# EAGLE schematic proto4-1pp (EAGLE 6.6.0), part 1 of 3
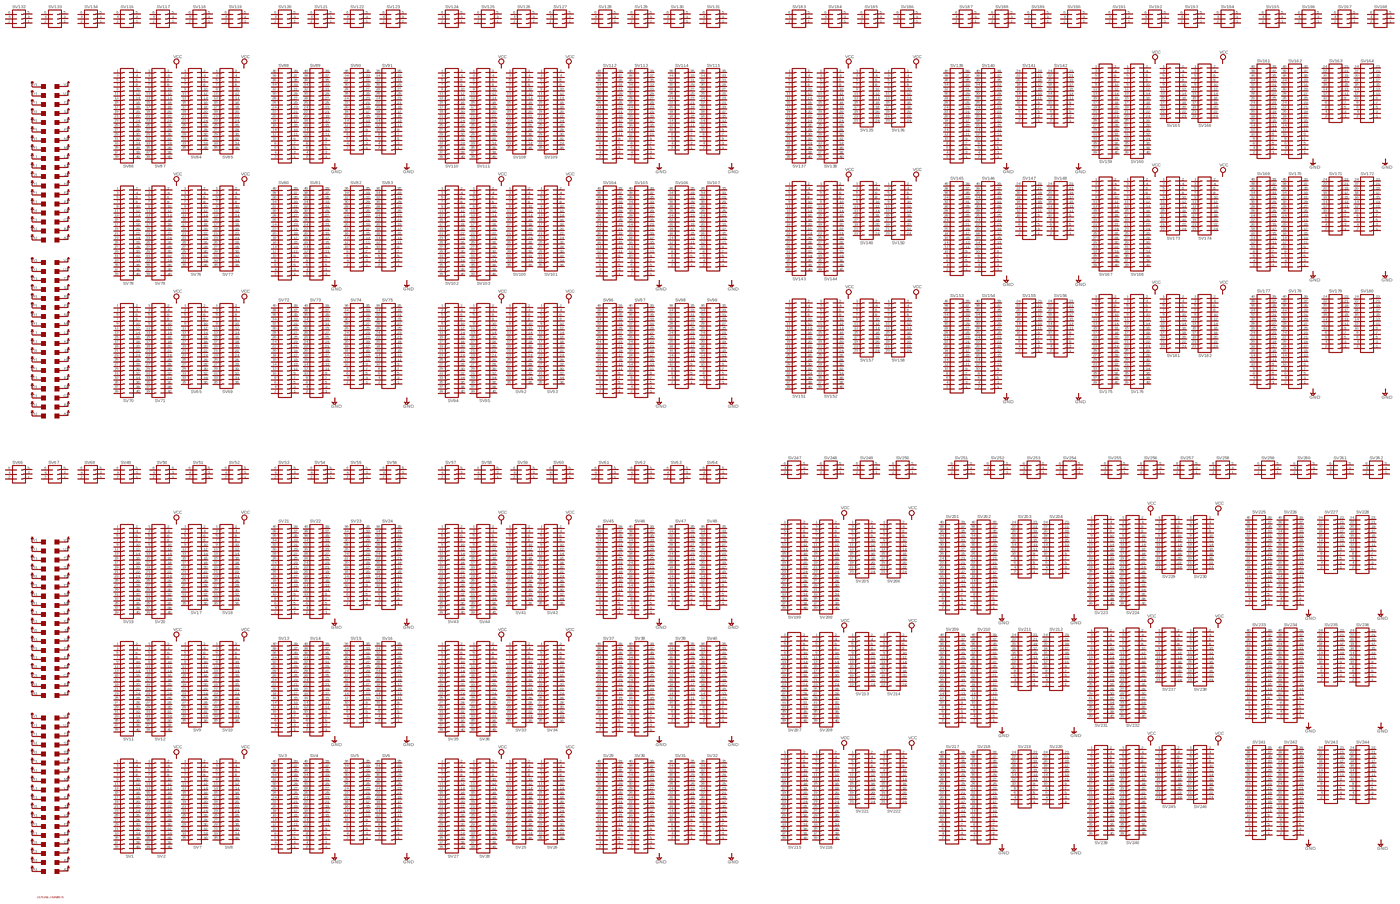
[diagram p0: schematic, sheet 1, overview]
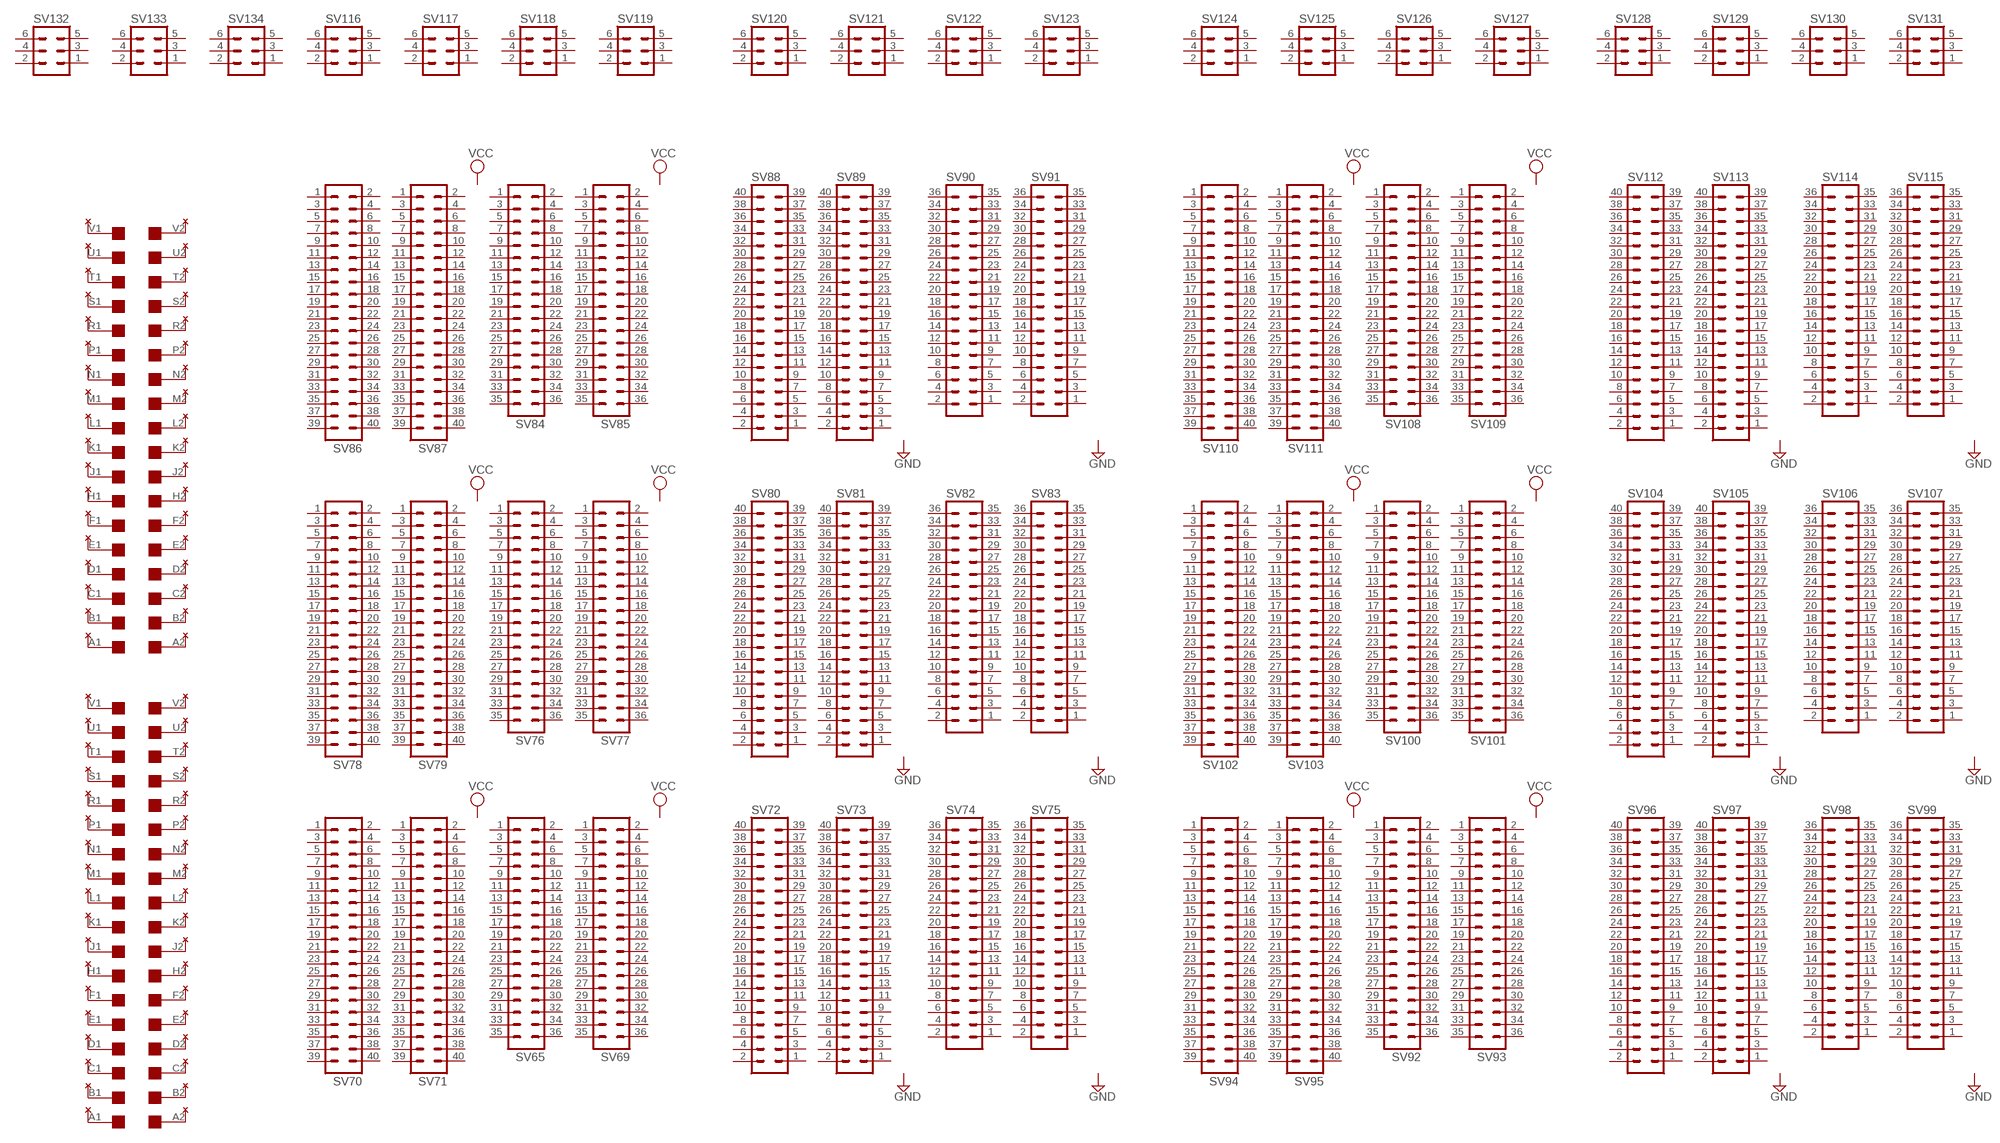
[diagram p1: schematic, sheet 1, part 1 of 4]
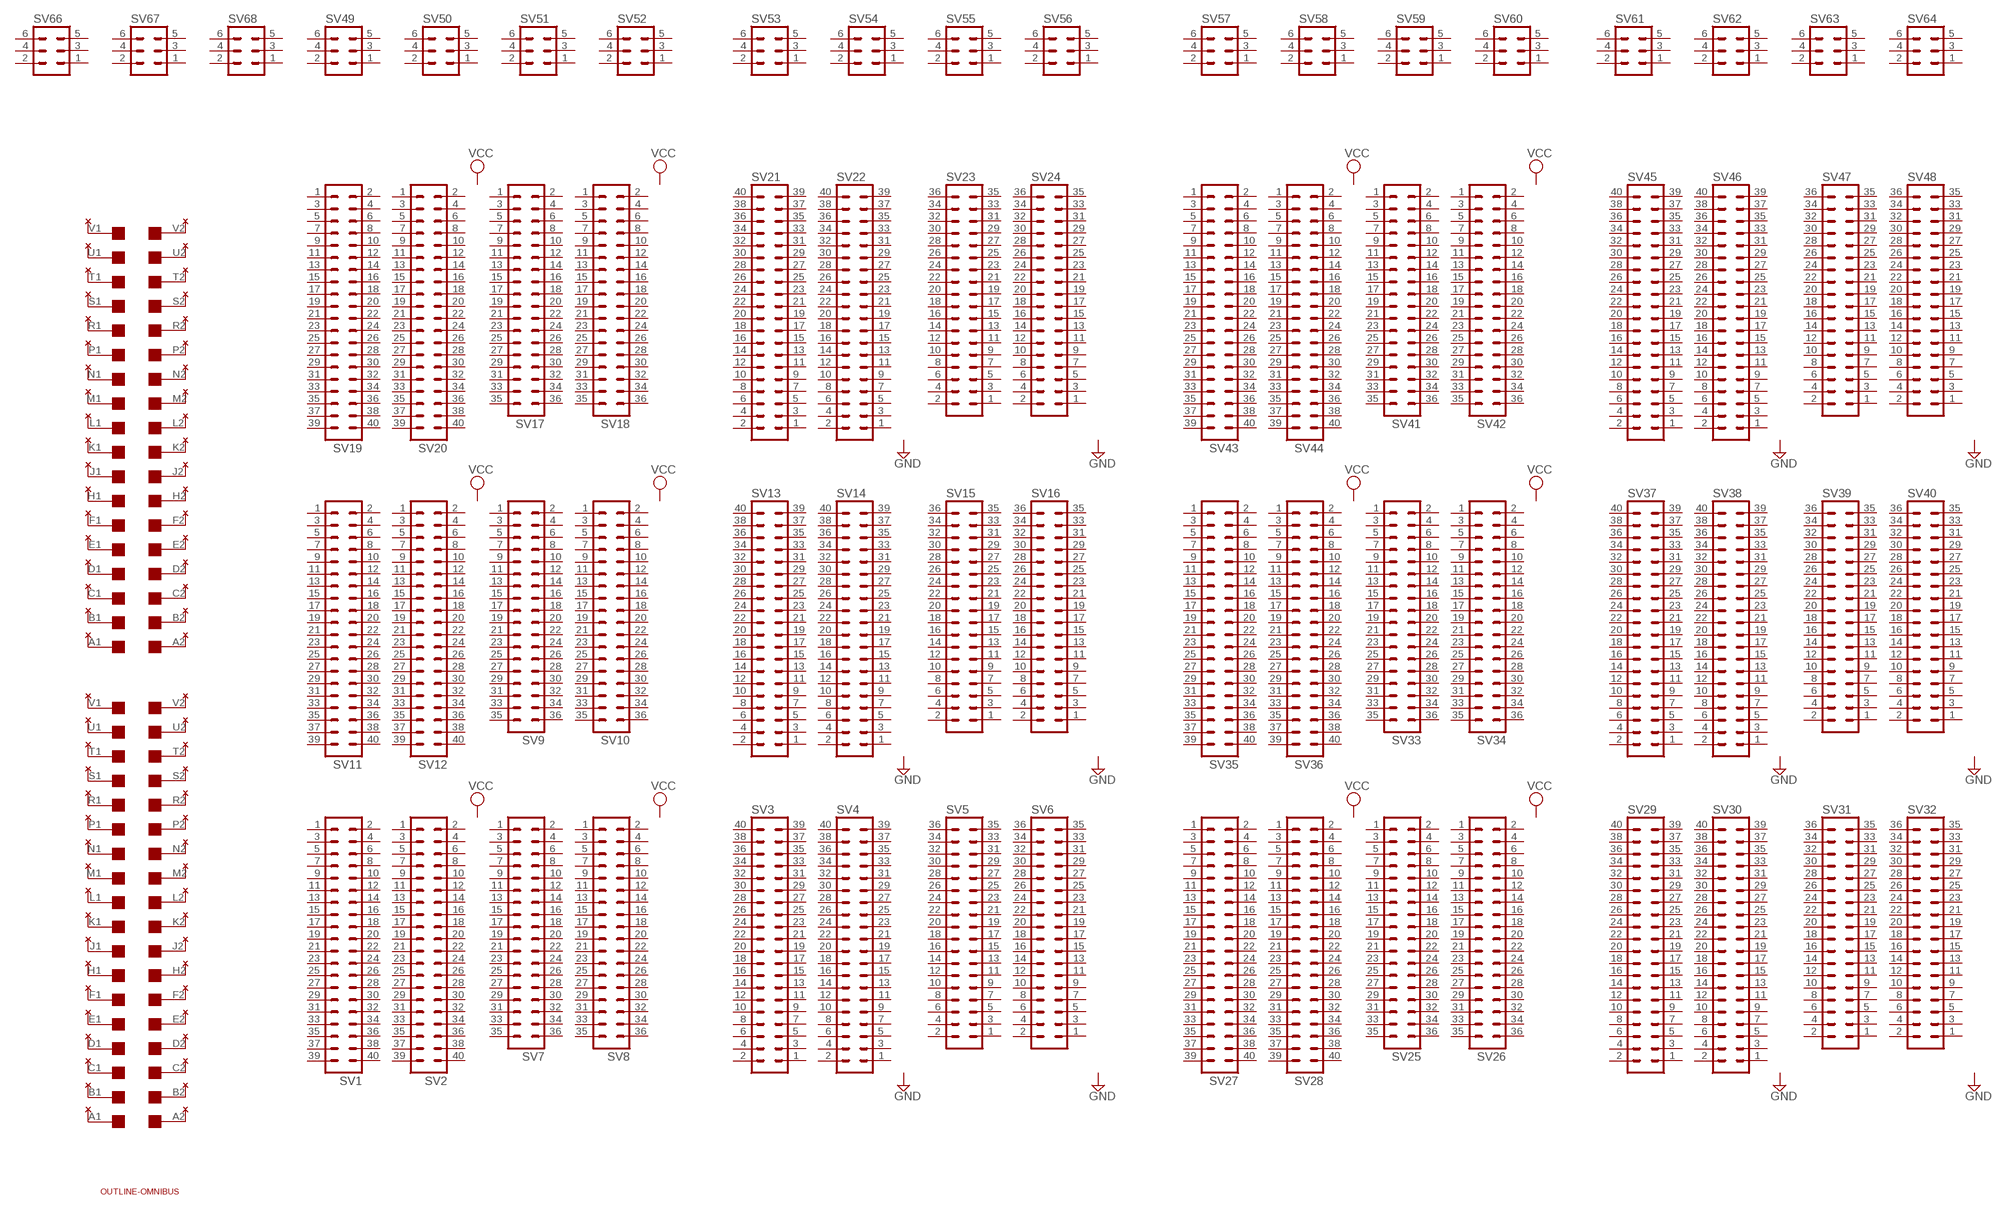
[diagram p2: schematic, sheet 1, part 2 of 4]
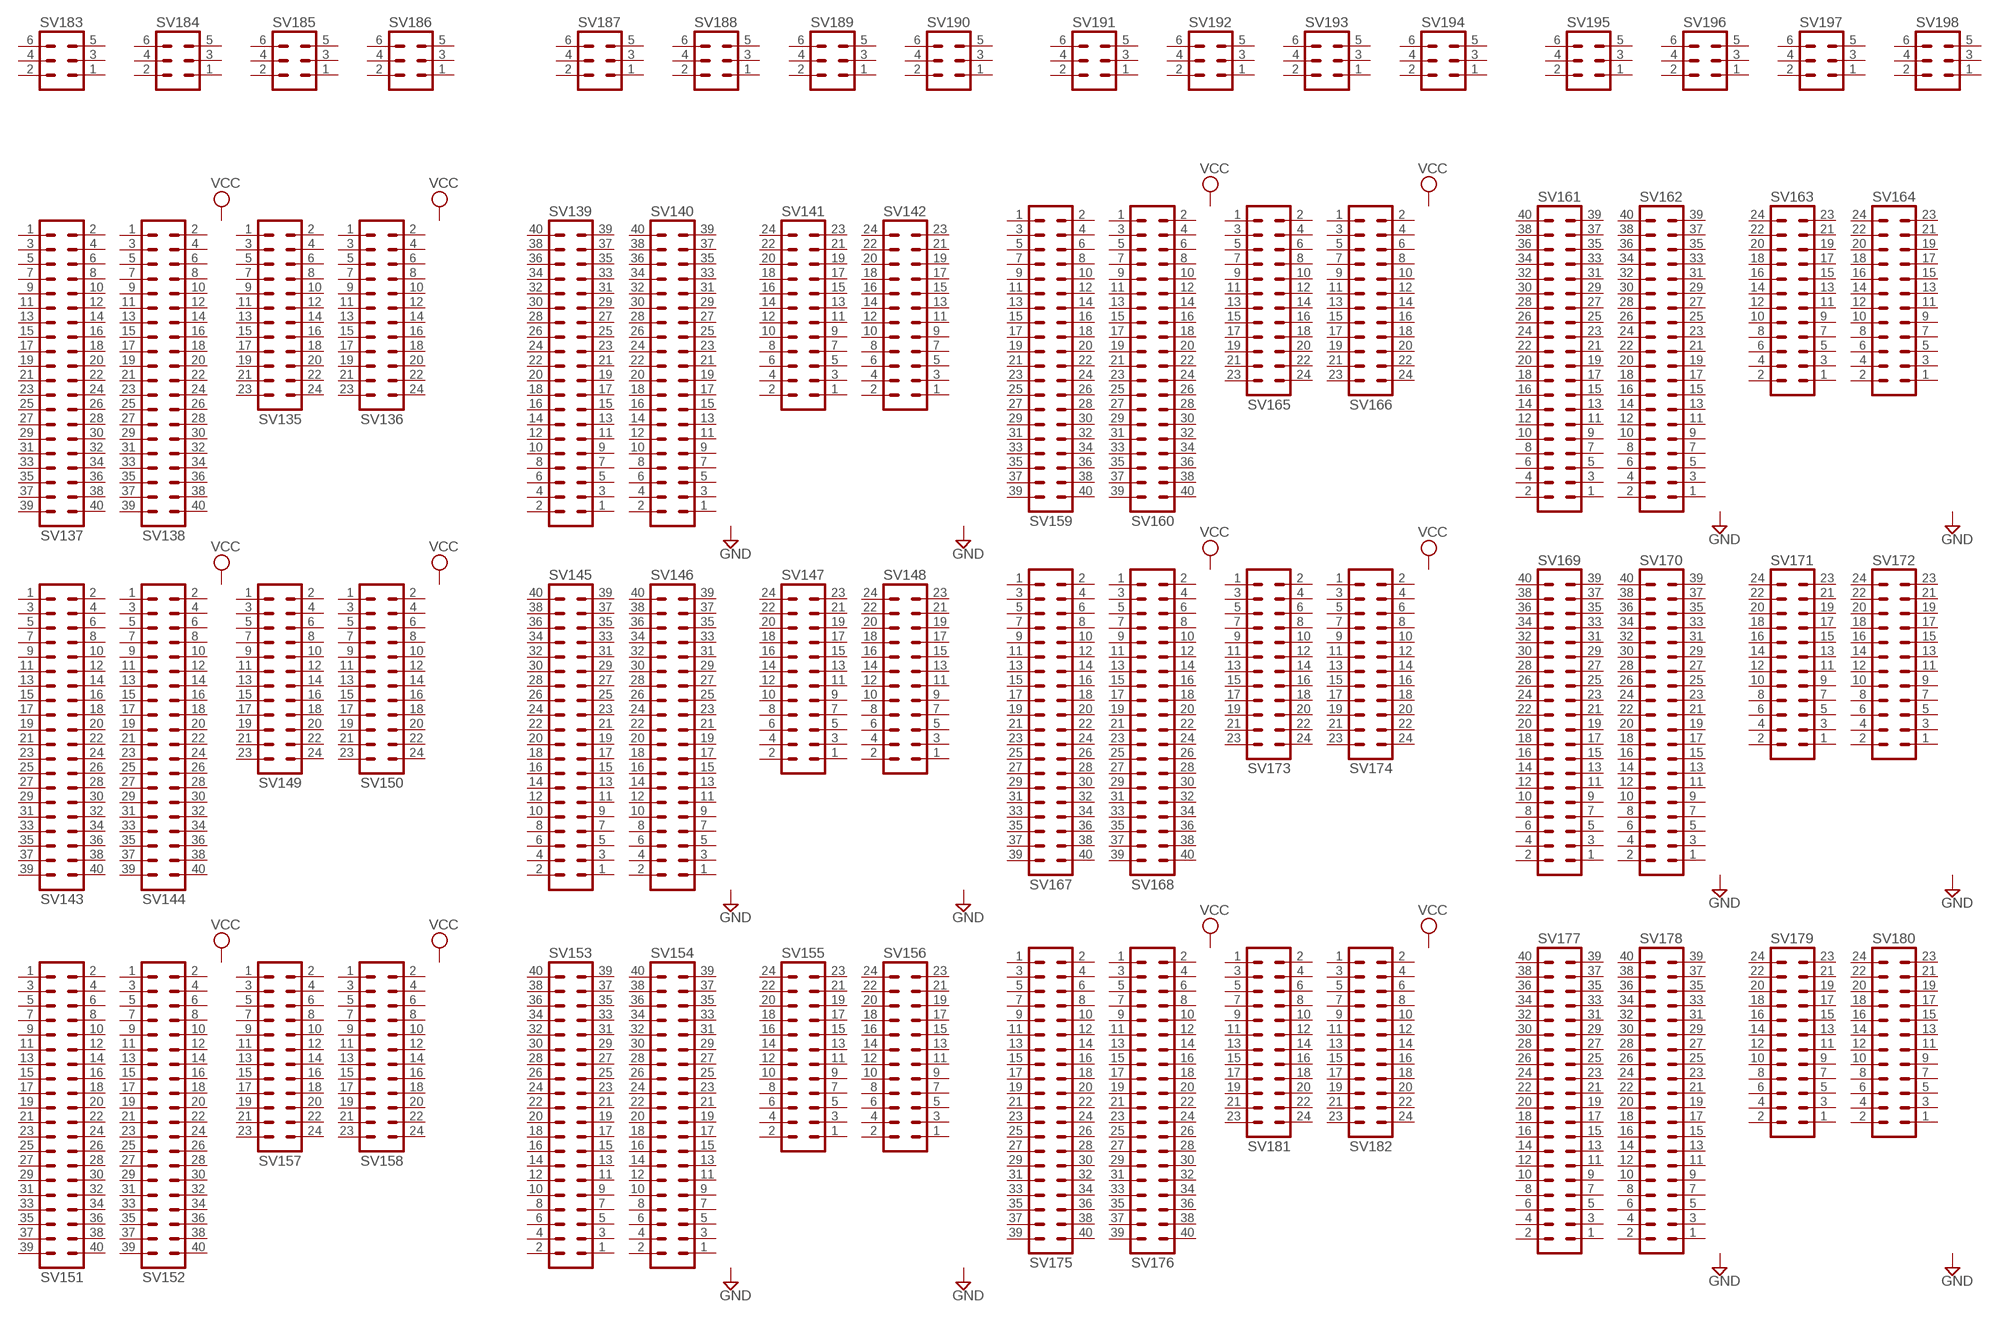
[diagram p3: schematic, sheet 1, part 3 of 4]
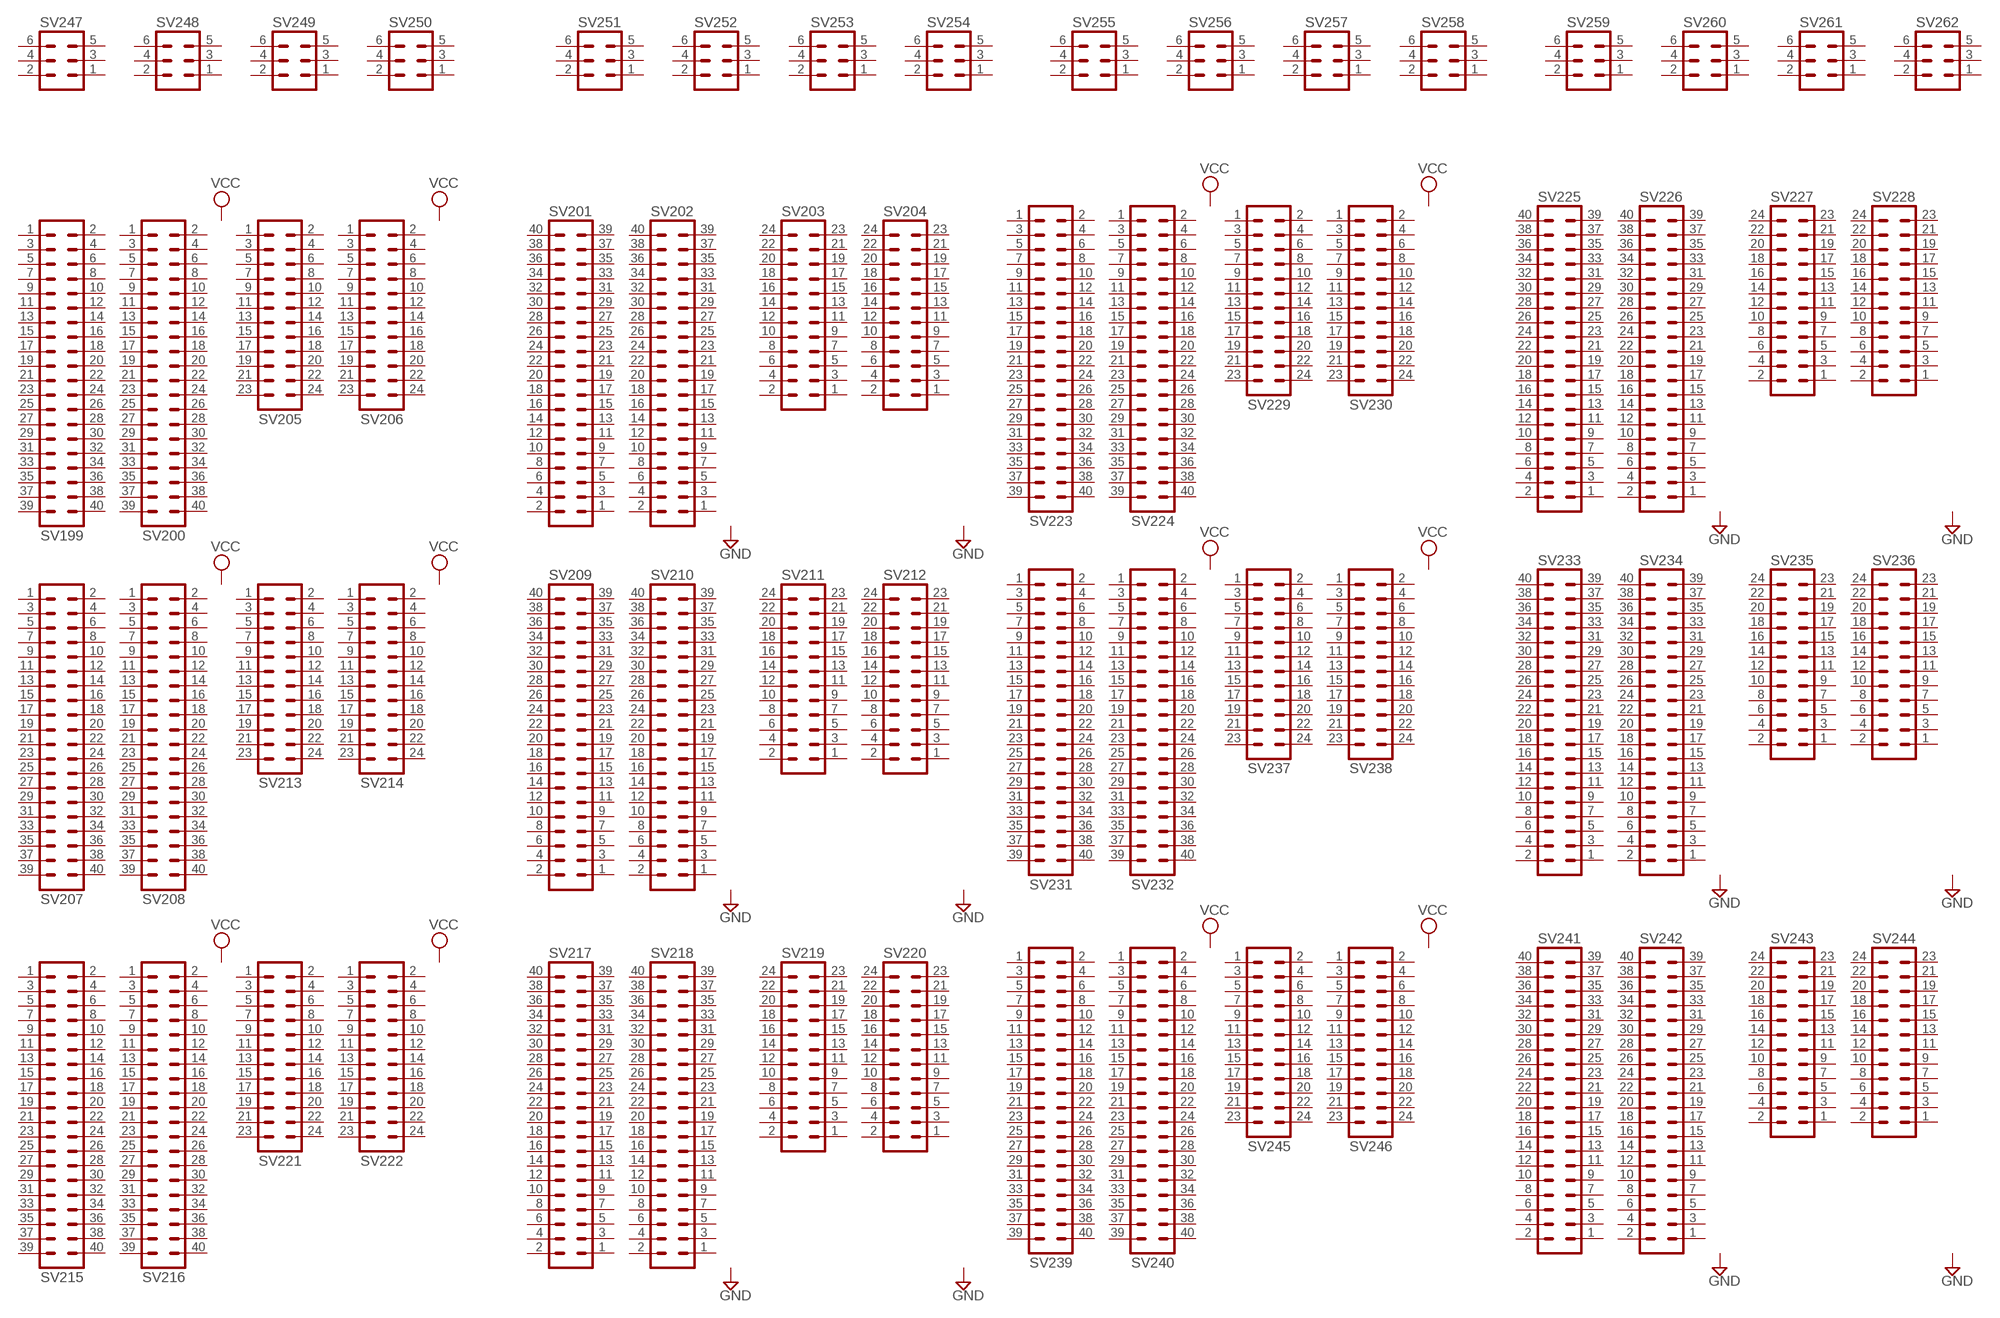
[diagram p4: schematic, sheet 1, part 4 of 4]

## Parts
A  EDGE-2CONNECTOR  [EDGE-CON2]
A1  EDGE-2CONNECTOR  [EDGE-CON2]
B  EDGE-2CONNECTOR  [EDGE-CON2]
B1  EDGE-2CONNECTOR  [EDGE-CON2]
SV1  MA20-2  [MA20-2]
SV2  MA20-2  [MA20-2]
SV3  MA20-2  [MA20-2]
SV4  MA20-2  [MA20-2]
SV5  MA18-2  [MA18-2]
SV6  MA18-2  [MA18-2]
SV7  MA18-2  [MA18-2]
SV8  MA18-2  [MA18-2]
SV9  MA18-2  [MA18-2]
SV10  MA18-2  [MA18-2]
SV11  MA20-2  [MA20-2]
SV12  MA20-2  [MA20-2]
SV13  MA20-2  [MA20-2]
SV14  MA20-2  [MA20-2]
SV15  MA18-2  [MA18-2]
SV16  MA18-2  [MA18-2]
SV17  MA18-2  [MA18-2]
SV18  MA18-2  [MA18-2]
SV19  MA20-2  [MA20-2]
SV20  MA20-2  [MA20-2]
SV21  MA20-2  [MA20-2]
SV22  MA20-2  [MA20-2]
SV23  MA18-2  [MA18-2]
SV24  MA18-2  [MA18-2]
SV25  MA18-2  [MA18-2]
SV26  MA18-2  [MA18-2]
SV27  MA20-2  [MA20-2]
SV28  MA20-2  [MA20-2]
SV29  MA20-2  [MA20-2]
SV30  MA20-2  [MA20-2]
SV31  MA18-2  [MA18-2]
SV32  MA18-2  [MA18-2]
SV33  MA18-2  [MA18-2]
SV34  MA18-2  [MA18-2]
SV35  MA20-2  [MA20-2]
SV36  MA20-2  [MA20-2]
SV37  MA20-2  [MA20-2]
SV38  MA20-2  [MA20-2]
SV39  MA18-2  [MA18-2]
SV40  MA18-2  [MA18-2]
SV41  MA18-2  [MA18-2]
SV42  MA18-2  [MA18-2]
SV43  MA20-2  [MA20-2]
SV44  MA20-2  [MA20-2]
SV45  MA20-2  [MA20-2]
SV46  MA20-2  [MA20-2]
SV47  MA18-2  [MA18-2]
SV48  MA18-2  [MA18-2]
SV49  MA03-2  [MA03-2]
SV50  MA03-2  [MA03-2]
SV51  MA03-2  [MA03-2]
SV52  MA03-2  [MA03-2]
SV53  MA03-2  [MA03-2]
SV54  MA03-2  [MA03-2]
SV55  MA03-2  [MA03-2]
SV56  MA03-2  [MA03-2]
SV57  MA03-2  [MA03-2]
SV58  MA03-2  [MA03-2]
SV59  MA03-2  [MA03-2]
SV60  MA03-2  [MA03-2]
SV61  MA03-2  [MA03-2]
SV62  MA03-2  [MA03-2]
SV63  MA03-2  [MA03-2]
SV64  MA03-2  [MA03-2]
SV65  MA18-2  [MA18-2]
SV66  MA03-2  [MA03-2]
SV67  MA03-2  [MA03-2]
SV68  MA03-2  [MA03-2]
SV69  MA18-2  [MA18-2]
SV70  MA20-2  [MA20-2]
SV71  MA20-2  [MA20-2]
SV72  MA20-2  [MA20-2]
SV73  MA20-2  [MA20-2]
SV74  MA18-2  [MA18-2]
SV75  MA18-2  [MA18-2]
SV76  MA18-2  [MA18-2]
SV77  MA18-2  [MA18-2]
SV78  MA20-2  [MA20-2]
SV79  MA20-2  [MA20-2]
SV80  MA20-2  [MA20-2]
SV81  MA20-2  [MA20-2]
SV82  MA18-2  [MA18-2]
SV83  MA18-2  [MA18-2]
SV84  MA18-2  [MA18-2]
SV85  MA18-2  [MA18-2]
SV86  MA20-2  [MA20-2]
SV87  MA20-2  [MA20-2]
SV88  MA20-2  [MA20-2]
SV89  MA20-2  [MA20-2]
SV90  MA18-2  [MA18-2]
SV91  MA18-2  [MA18-2]
SV92  MA18-2  [MA18-2]
SV93  MA18-2  [MA18-2]
SV94  MA20-2  [MA20-2]
SV95  MA20-2  [MA20-2]
SV96  MA20-2  [MA20-2]
SV97  MA20-2  [MA20-2]
SV98  MA18-2  [MA18-2]
SV99  MA18-2  [MA18-2]
SV100  MA18-2  [MA18-2]
SV101  MA18-2  [MA18-2]
SV102  MA20-2  [MA20-2]
SV103  MA20-2  [MA20-2]
SV104  MA20-2  [MA20-2]
SV105  MA20-2  [MA20-2]
SV106  MA18-2  [MA18-2]
SV107  MA18-2  [MA18-2]
SV108  MA18-2  [MA18-2]
SV109  MA18-2  [MA18-2]
SV110  MA20-2  [MA20-2]
SV111  MA20-2  [MA20-2]
SV112  MA20-2  [MA20-2]
SV113  MA20-2  [MA20-2]
SV114  MA18-2  [MA18-2]
SV115  MA18-2  [MA18-2]
SV116  MA03-2  [MA03-2]
SV117  MA03-2  [MA03-2]
SV118  MA03-2  [MA03-2]
SV119  MA03-2  [MA03-2]
SV120  MA03-2  [MA03-2]
SV121  MA03-2  [MA03-2]
SV122  MA03-2  [MA03-2]
SV123  MA03-2  [MA03-2]
SV124  MA03-2  [MA03-2]
SV125  MA03-2  [MA03-2]
SV126  MA03-2  [MA03-2]
SV127  MA03-2  [MA03-2]
SV128  MA03-2  [MA03-2]
SV129  MA03-2  [MA03-2]
SV130  MA03-2  [MA03-2]
SV131  MA03-2  [MA03-2]
SV132  MA03-2  [MA03-2]
SV133  MA03-2  [MA03-2]
SV134  MA03-2  [MA03-2]
SV135  MA12-2  [MA12-2]
SV136  MA12-2  [MA12-2]
SV137  MA20-2  [MA20-2]
SV138  MA20-2  [MA20-2]
SV139  MA20-2  [MA20-2]
SV140  MA20-2  [MA20-2]
SV141  MA12-2  [MA12-2]
SV142  MA12-2  [MA12-2]
SV143  MA20-2  [MA20-2]
SV144  MA20-2  [MA20-2]
SV145  MA20-2  [MA20-2]
SV146  MA20-2  [MA20-2]
SV147  MA12-2  [MA12-2]
SV148  MA12-2  [MA12-2]
SV149  MA12-2  [MA12-2]
SV150  MA12-2  [MA12-2]
SV151  MA20-2  [MA20-2]
SV152  MA20-2  [MA20-2]
SV153  MA20-2  [MA20-2]
SV154  MA20-2  [MA20-2]
SV155  MA12-2  [MA12-2]
SV156  MA12-2  [MA12-2]
SV157  MA12-2  [MA12-2]
SV158  MA12-2  [MA12-2]
SV159  MA20-2  [MA20-2]
SV160  MA20-2  [MA20-2]
SV161  MA20-2  [MA20-2]
SV162  MA20-2  [MA20-2]
SV163  MA12-2  [MA12-2]
SV164  MA12-2  [MA12-2]
SV165  MA12-2  [MA12-2]
SV166  MA12-2  [MA12-2]
SV167  MA20-2  [MA20-2]
SV168  MA20-2  [MA20-2]
SV169  MA20-2  [MA20-2]
SV170  MA20-2  [MA20-2]
SV171  MA12-2  [MA12-2]
SV172  MA12-2  [MA12-2]
SV173  MA12-2  [MA12-2]
SV174  MA12-2  [MA12-2]
SV175  MA20-2  [MA20-2]
SV176  MA20-2  [MA20-2]
SV177  MA20-2  [MA20-2]
SV178  MA20-2  [MA20-2]
SV179  MA12-2  [MA12-2]
SV180  MA12-2  [MA12-2]
SV181  MA12-2  [MA12-2]
SV182  MA12-2  [MA12-2]
SV183  MA03-2  [MA03-2]
SV184  MA03-2  [MA03-2]
SV185  MA03-2  [MA03-2]
SV186  MA03-2  [MA03-2]
SV187  MA03-2  [MA03-2]
SV188  MA03-2  [MA03-2]
SV189  MA03-2  [MA03-2]
SV190  MA03-2  [MA03-2]
SV191  MA03-2  [MA03-2]
SV192  MA03-2  [MA03-2]
SV193  MA03-2  [MA03-2]
SV194  MA03-2  [MA03-2]
SV195  MA03-2  [MA03-2]
SV196  MA03-2  [MA03-2]
SV197  MA03-2  [MA03-2]
SV198  MA03-2  [MA03-2]
SV199  MA20-2  [MA20-2]
SV200  MA20-2  [MA20-2]
SV201  MA20-2  [MA20-2]
SV202  MA20-2  [MA20-2]
SV203  MA12-2  [MA12-2]
SV204  MA12-2  [MA12-2]
SV205  MA12-2  [MA12-2]
SV206  MA12-2  [MA12-2]
SV207  MA20-2  [MA20-2]
SV208  MA20-2  [MA20-2]
SV209  MA20-2  [MA20-2]
SV210  MA20-2  [MA20-2]
SV211  MA12-2  [MA12-2]
SV212  MA12-2  [MA12-2]
SV213  MA12-2  [MA12-2]
SV214  MA12-2  [MA12-2]
SV215  MA20-2  [MA20-2]
SV216  MA20-2  [MA20-2]
SV217  MA20-2  [MA20-2]
SV218  MA20-2  [MA20-2]
SV219  MA12-2  [MA12-2]
SV220  MA12-2  [MA12-2]
SV221  MA12-2  [MA12-2]
SV222  MA12-2  [MA12-2]
SV223  MA20-2  [MA20-2]
SV224  MA20-2  [MA20-2]
SV225  MA20-2  [MA20-2]
SV226  MA20-2  [MA20-2]
SV227  MA12-2  [MA12-2]
SV228  MA12-2  [MA12-2]
SV229  MA12-2  [MA12-2]
SV230  MA12-2  [MA12-2]
SV231  MA20-2  [MA20-2]
SV232  MA20-2  [MA20-2]
SV233  MA20-2  [MA20-2]
SV234  MA20-2  [MA20-2]
SV235  MA12-2  [MA12-2]
SV236  MA12-2  [MA12-2]
SV237  MA12-2  [MA12-2]
SV238  MA12-2  [MA12-2]
SV239  MA20-2  [MA20-2]
SV240  MA20-2  [MA20-2]
SV241  MA20-2  [MA20-2]
SV242  MA20-2  [MA20-2]
SV243  MA12-2  [MA12-2]
SV244  MA12-2  [MA12-2]
SV245  MA12-2  [MA12-2]
SV246  MA12-2  [MA12-2]
SV247  MA03-2  [MA03-2]
SV248  MA03-2  [MA03-2]
SV249  MA03-2  [MA03-2]
SV250  MA03-2  [MA03-2]
SV251  MA03-2  [MA03-2]
SV252  MA03-2  [MA03-2]
SV253  MA03-2  [MA03-2]
SV254  MA03-2  [MA03-2]
SV255  MA03-2  [MA03-2]
SV256  MA03-2  [MA03-2]
SV257  MA03-2  [MA03-2]
SV258  MA03-2  [MA03-2]
SV259  MA03-2  [MA03-2]
SV260  MA03-2  [MA03-2]
SV261  MA03-2  [MA03-2]
SV262  MA03-2  [MA03-2]
U$1  THRU-HOLE2A  [THRU-HOLEA]
U$3  THRU-HOLE2A  [THRU-HOLEA]
U$5  THRU-HOLE2A  [THRU-HOLEA]
U$6  THRU-HOLE2A  [THRU-HOLEA]
U$7  OUTLINE-OMNIBUS  [OMNIBUS]

## Nets
N$1: A.K2 U$3.K2
N$2: A.J2 U$3.J2
N$3: A.H2 U$3.H2
N$4: A.L2 U$3.L2
N$5: A.M2 U$3.M2
N$6: A.N2 U$3.N2
N$7: A.P2 U$3.P2
N$8: A.F2 U$3.F2
N$9: A.E2 U$3.E2
N$10: A.D2 U$3.D2
N$11: A.A2 U$3.A2
N$12: A.R2 U$3.R2
N$13: A.S2 U$3.S2
N$14: A.B2 U$3.B2
N$15: A.C2 U$3.C2
N$16: A.T2 U$3.T2
N$17: A.U2 U$3.U2
N$18: A.V2 U$3.V2
N$19: A.A1 U$3.A1
N$20: A.V1 U$3.V1
N$21: A.U1 U$3.U1
N$22: A.T1 U$3.T1
N$23: A.S1 U$3.S1
N$24: A.R1 U$3.R1
N$25: A.P1 U$3.P1
N$26: A.N1 U$3.N1
N$27: A.M1 U$3.M1
N$28: A.L1 U$3.L1
N$29: A.K1 U$3.K1
N$30: A.J1 U$3.J1
N$31: A.H1 U$3.H1
N$32: A.F1 U$3.F1
N$33: A.E1 U$3.E1
N$34: A.D1 U$3.D1
N$35: A.C1 U$3.C1
N$36: A.B1 U$3.B1
N$37: B.C2 U$5.C2
N$38: B.A2 U$5.A2
N$39: A1.A2 U$1.A2
N$40: A1.C2 U$1.C2
N$41: B1.C2 U$6.C2
N$42: B1.A2 U$6.A2
N$263: B.K2 U$5.K2
N$264: B.J2 U$5.J2
N$265: B.H2 U$5.H2
N$266: B.L2 U$5.L2
N$267: B.M2 U$5.M2
N$268: B.N2 U$5.N2
N$269: B.P2 U$5.P2
N$270: B.F2 U$5.F2
N$271: B.E2 U$5.E2
N$272: B.D2 U$5.D2
N$273: B.R2 U$5.R2
N$274: B.S2 U$5.S2
N$275: B.B2 U$5.B2
N$276: B.T2 U$5.T2
N$277: B.U2 U$5.U2
N$278: B.V2 U$5.V2
N$279: B.A1 U$5.A1
N$280: B.V1 U$5.V1
N$281: B.U1 U$5.U1
N$282: B.T1 U$5.T1
N$283: B.S1 U$5.S1
N$284: B.R1 U$5.R1
N$285: B.P1 U$5.P1
N$286: B.N1 U$5.N1
N$287: B.M1 U$5.M1
N$288: B.L1 U$5.L1
N$289: B.K1 U$5.K1
N$290: B.J1 U$5.J1
N$291: B.H1 U$5.H1
N$292: B.F1 U$5.F1
N$293: B.E1 U$5.E1
N$294: B.D1 U$5.D1
N$295: B.C1 U$5.C1
N$296: B.B1 U$5.B1
N$563: A1.K2 U$1.K2
N$564: A1.J2 U$1.J2
N$565: A1.H2 U$1.H2
N$566: A1.L2 U$1.L2
N$567: A1.M2 U$1.M2
N$568: A1.N2 U$1.N2
N$569: A1.P2 U$1.P2
N$570: A1.F2 U$1.F2
N$571: A1.E2 U$1.E2
N$572: A1.D2 U$1.D2
N$573: A1.R2 U$1.R2
N$574: A1.S2 U$1.S2
N$575: A1.B2 U$1.B2
N$576: A1.T2 U$1.T2
N$577: A1.U2 U$1.U2
N$578: A1.V2 U$1.V2
N$579: A1.A1 U$1.A1
N$580: A1.V1 U$1.V1
N$581: A1.U1 U$1.U1
N$582: A1.T1 U$1.T1
N$583: A1.S1 U$1.S1
N$584: A1.R1 U$1.R1
N$585: A1.P1 U$1.P1
N$586: A1.N1 U$1.N1
N$587: A1.M1 U$1.M1
N$588: A1.L1 U$1.L1
N$589: A1.K1 U$1.K1
N$590: A1.J1 U$1.J1
N$591: A1.H1 U$1.H1
N$592: A1.F1 U$1.F1
N$593: A1.E1 U$1.E1
N$594: A1.D1 U$1.D1
N$595: A1.C1 U$1.C1
N$596: A1.B1 U$1.B1
N$825: B1.K2 U$6.K2
N$826: B1.J2 U$6.J2
N$827: B1.H2 U$6.H2
N$828: B1.L2 U$6.L2
N$829: B1.M2 U$6.M2
N$830: B1.N2 U$6.N2
N$831: B1.P2 U$6.P2
N$832: B1.F2 U$6.F2
N$833: B1.E2 U$6.E2
N$834: B1.D2 U$6.D2
N$835: B1.R2 U$6.R2
N$836: B1.S2 U$6.S2
N$837: B1.B2 U$6.B2
N$838: B1.T2 U$6.T2
N$839: B1.U2 U$6.U2
N$840: B1.V2 U$6.V2
N$841: B1.A1 U$6.A1
N$842: B1.V1 U$6.V1
N$843: B1.U1 U$6.U1
N$844: B1.T1 U$6.T1
N$845: B1.S1 U$6.S1
N$846: B1.R1 U$6.R1
N$847: B1.P1 U$6.P1
N$848: B1.N1 U$6.N1
N$849: B1.M1 U$6.M1
N$850: B1.L1 U$6.L1
N$851: B1.K1 U$6.K1
N$852: B1.J1 U$6.J1
N$853: B1.H1 U$6.H1
N$854: B1.F1 U$6.F1
N$855: B1.E1 U$6.E1
N$856: B1.D1 U$6.D1
N$857: B1.C1 U$6.C1
N$858: B1.B1 U$6.B1